# EAGLE design shieldV5 (EAGLE 8.7.1)

## Sheet 1 of 6
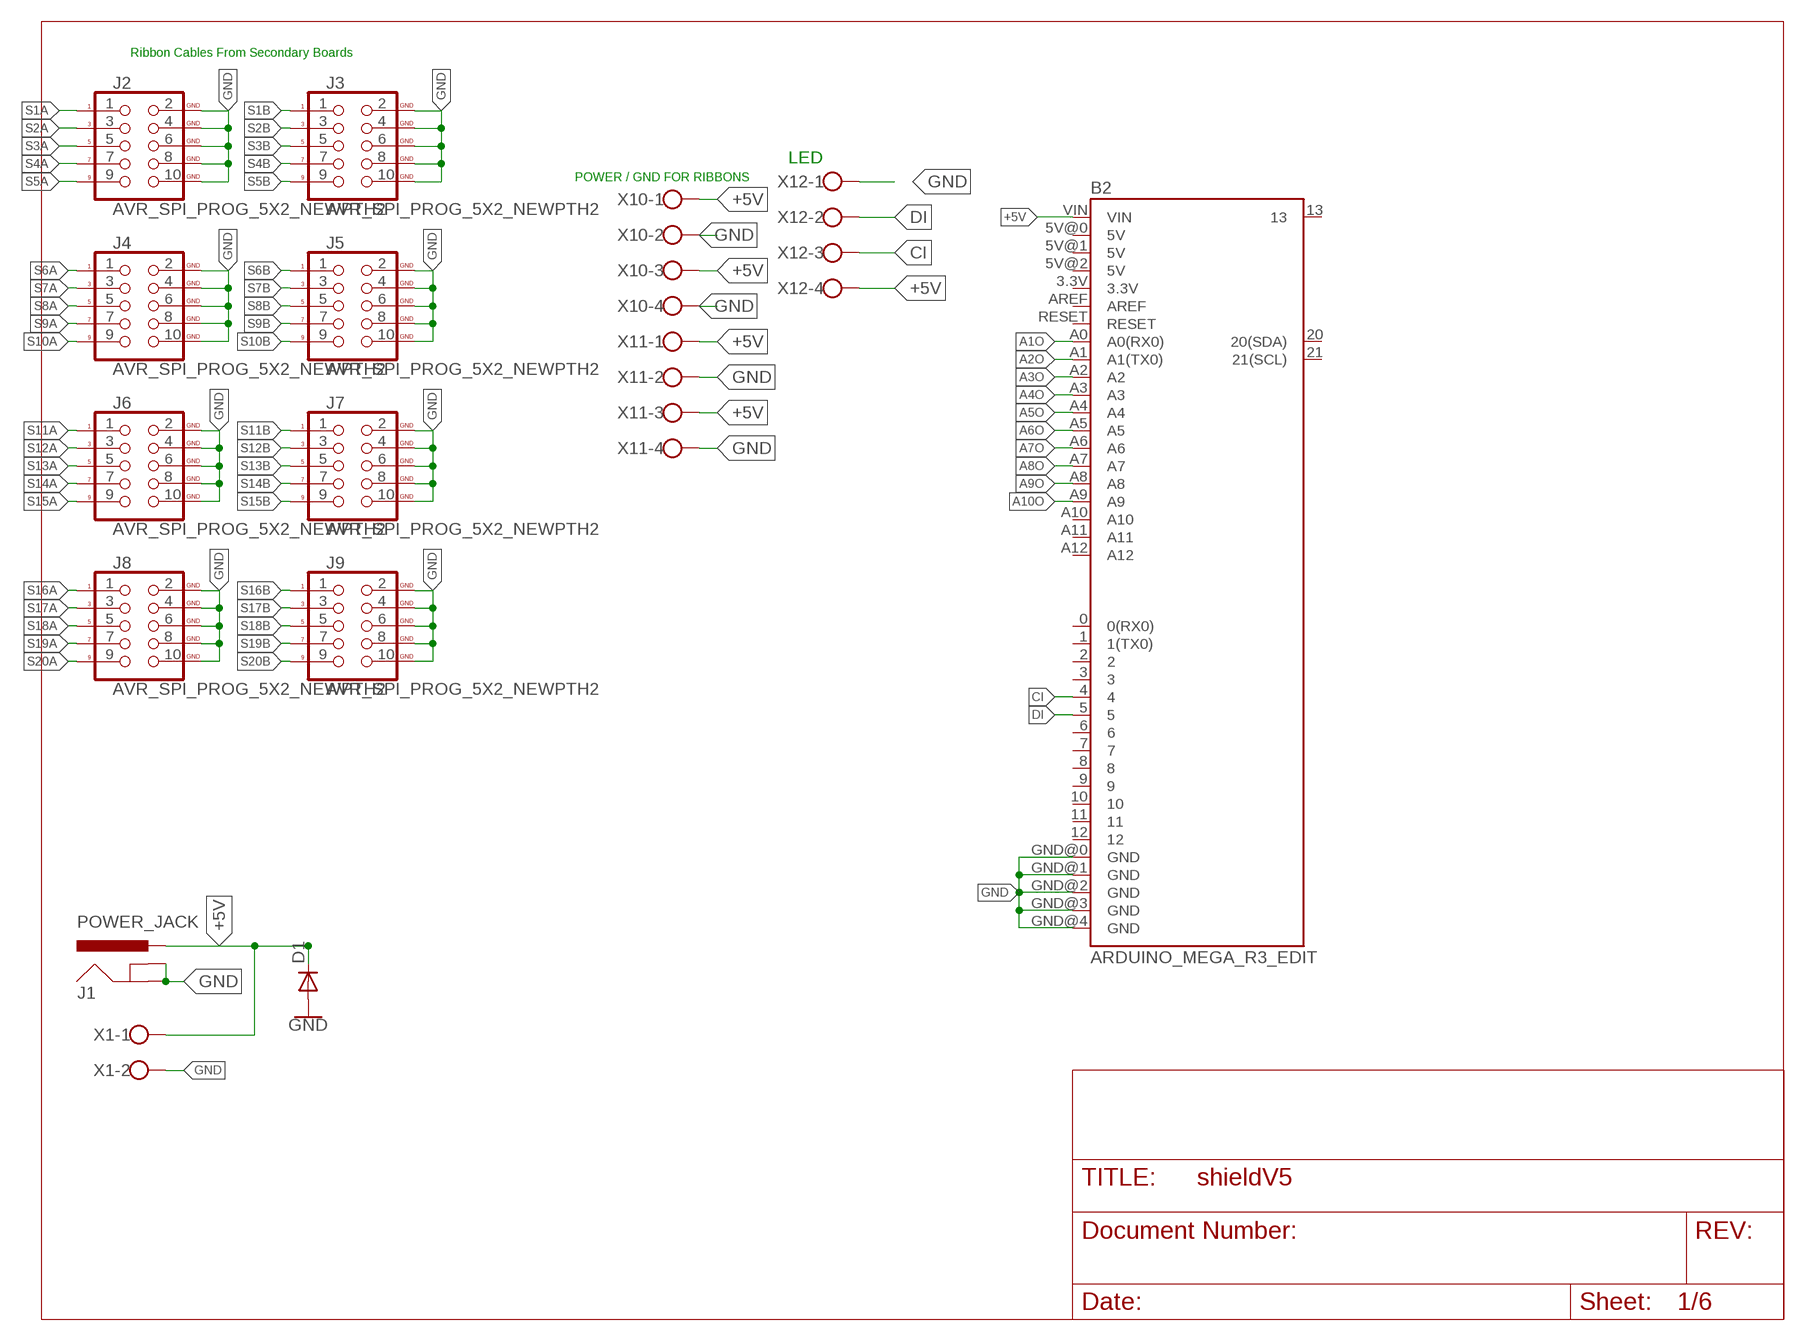
[diagram p0: schematic, sheet 1, part 1 of 2]
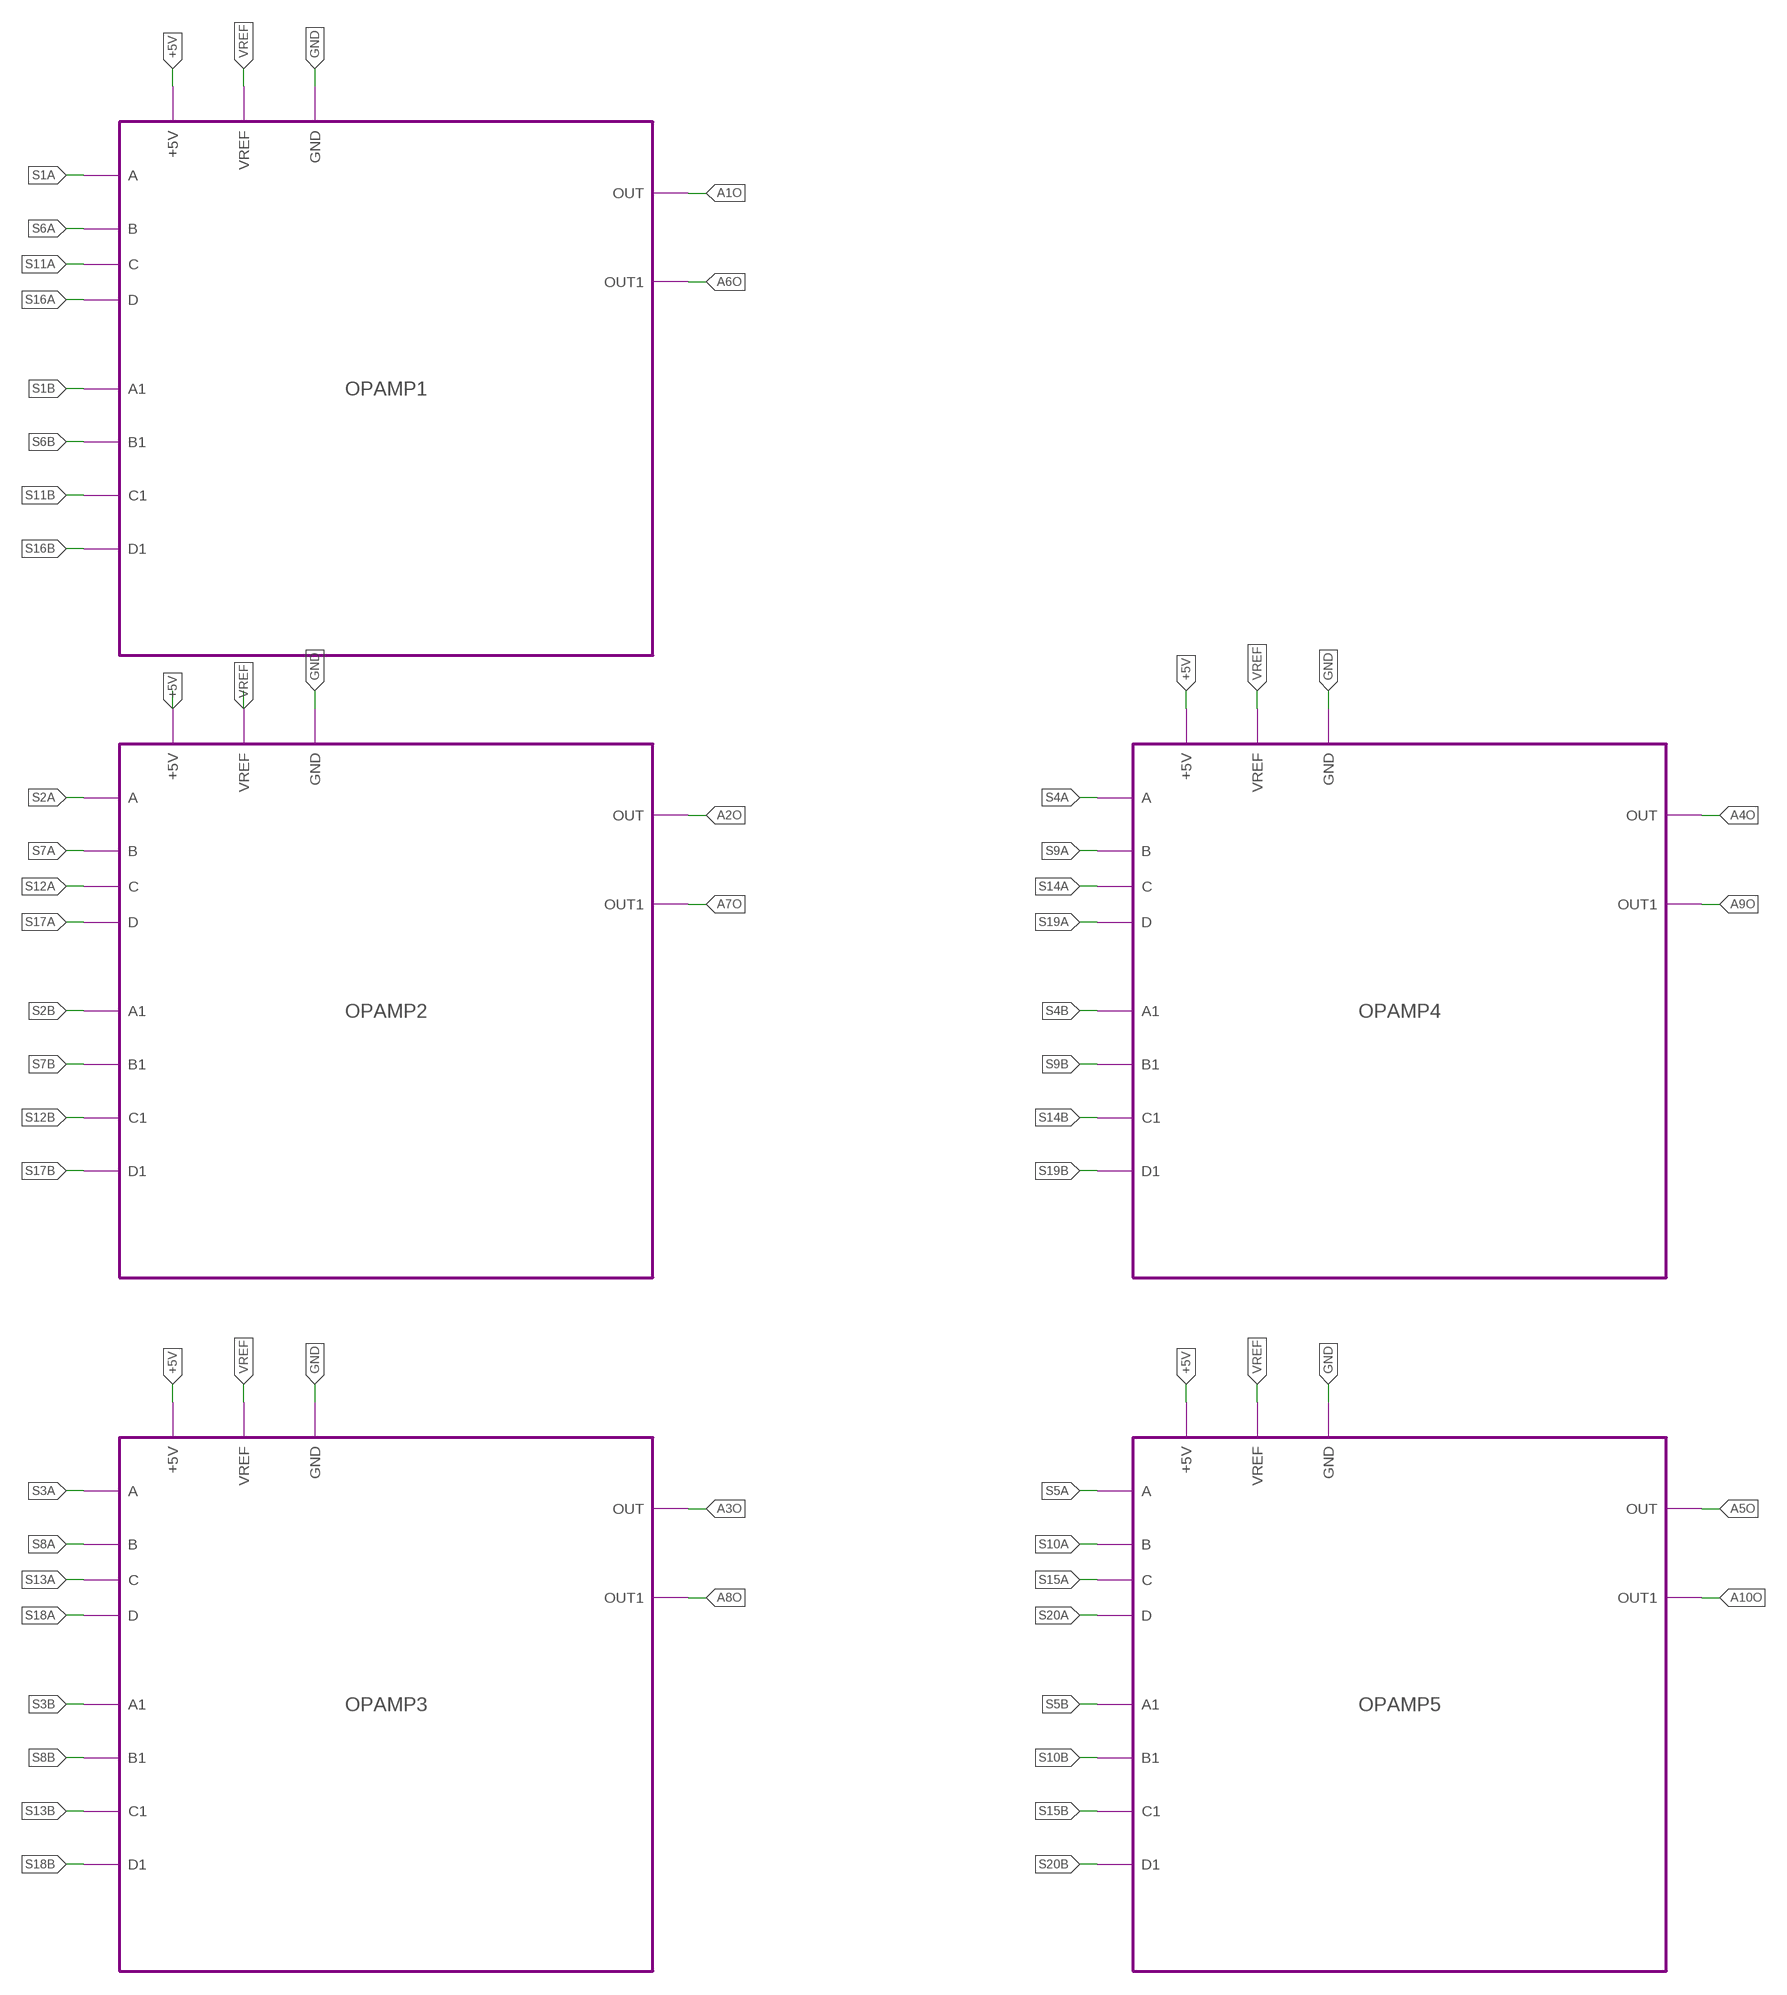
[diagram p1: schematic, sheet 1, part 2 of 2]

### Parts
B2  ARDUINO_MEGA_R3_EDIT  [ARDUINO_MEGA_EDIT]
D1  DIODE-DO-214AC  [DO-214AC]
J1  POWER_JACK  [POWER_JACK_PTH]
J2  AVR_SPI_PROG_5X2_NEWPTH2  [2X5-SHROUDED]
J3  AVR_SPI_PROG_5X2_NEWPTH2  [2X5-SHROUDED]
J4  AVR_SPI_PROG_5X2_NEWPTH2  [2X5-SHROUDED]
J5  AVR_SPI_PROG_5X2_NEWPTH2  [2X5-SHROUDED]
J6  AVR_SPI_PROG_5X2_NEWPTH2  [2X5-SHROUDED]
J7  AVR_SPI_PROG_5X2_NEWPTH2  [2X5-SHROUDED]
J8  AVR_SPI_PROG_5X2_NEWPTH2  [2X5-SHROUDED]
J9  AVR_SPI_PROG_5X2_NEWPTH2  [2X5-SHROUDED]
X1  W237-102  [W237-102]
X10  W237-4  [W237-4]
X11  W237-4  [W237-4]
X12  W237-4  [W237-4]

### Module instances
OPAMP1 = OPAMP
OPAMP2 = OPAMP
OPAMP3 = OPAMP
OPAMP4 = OPAMP
OPAMP5 = OPAMP

### Nets
+5V: B2.VIN D1.C J1.PWR X1.1 X10.1 X10.3 X11.1 X11.3 X12.4 ; port OPAMP1.+5V OPAMP2.+5V OPAMP4.+5V OPAMP3.+5V OPAMP5.+5V
A1O: B2.A0(A0(RX0)) ; port OPAMP1.OUT
A2O: B2.A1(A1(TX0)) ; port OPAMP2.OUT
A3O: B2.A2 ; port OPAMP3.OUT
A4O: B2.A3 ; port OPAMP4.OUT
A5O: B2.A4 ; port OPAMP5.OUT
A6O: B2.A5 ; port OPAMP1.OUT1
A7O: B2.A6 ; port OPAMP2.OUT1
A8O: B2.A7 ; port OPAMP3.OUT1
A9O: B2.A8 ; port OPAMP4.OUT1
A10O: B2.A9 ; port OPAMP5.OUT1
CI: B2.4 X12.3
DI: B2.5 X12.2
GND: B2.GND@0(GND) B2.GND@1(GND) B2.GND@2(GND) B2.GND@3(GND) B2.GND@4(GND) D1.A J1.GND J1.GNDBREAK J2.2(GND) J2.4(GND) J2.6(GND) J2.8(GND) J2.10(GND) J3.2(GND) J3.4(GND) J3.6(GND) J3.8(GND) J3.10(GND) J4.2(GND) J4.4(GND) J4.6(GND) J4.8(GND) J4.10(GND) J5.2(GND) J5.4(GND) J5.6(GND) J5.8(GND) J5.10(GND) J6.2(GND) J6.4(GND) J6.6(GND) J6.8(GND) J6.10(GND) J7.2(GND) J7.4(GND) J7.6(GND) J7.8(GND) J7.10(GND) J8.2(GND) J8.4(GND) J8.6(GND) J8.8(GND) J8.10(GND) J9.2(GND) J9.4(GND) J9.6(GND) J9.8(GND) J9.10(GND) X1.2 X10.2 X10.4 X11.2 X11.4 X12.1 ; port OPAMP1.GND OPAMP2.GND OPAMP4.GND OPAMP3.GND OPAMP5.GND
S1A: J2.1 ; port OPAMP1.A
S1B: J3.1 ; port OPAMP1.A1
S2A: J2.3 ; port OPAMP2.A
S2B: J3.3 ; port OPAMP2.A1
S3A: J2.5 ; port OPAMP3.A
S3B: J3.5 ; port OPAMP3.A1
S4A: J2.7 ; port OPAMP4.A
S4B: J3.7 ; port OPAMP4.A1
S5A: J2.9 ; port OPAMP5.A
S5B: J3.9 ; port OPAMP5.A1
S6A: J4.1 ; port OPAMP1.B
S6B: J5.1 ; port OPAMP1.B1
S7A: J4.3 ; port OPAMP2.B
S7B: J5.3 ; port OPAMP2.B1
S8A: J4.5 ; port OPAMP3.B
S8B: J5.5 ; port OPAMP3.B1
S9A: J4.7 ; port OPAMP4.B
S9B: J5.7 ; port OPAMP4.B1
S10A: J4.9 ; port OPAMP5.B
S10B: J5.9 ; port OPAMP5.B1
S11A: J6.1 ; port OPAMP1.C
S11B: J7.1 ; port OPAMP1.C1
S12A: J6.3 ; port OPAMP2.C
S12B: J7.3 ; port OPAMP2.C1
S13A: J6.5 ; port OPAMP3.C
S13B: J7.5 ; port OPAMP3.C1
S14A: J6.7 ; port OPAMP4.C
S14B: J7.7 ; port OPAMP4.C1
S15A: J6.9 ; port OPAMP5.C
S15B: J7.9 ; port OPAMP5.C1
S16A: J8.1 ; port OPAMP1.D
S16B: J9.1 ; port OPAMP1.D1
S17A: J8.3 ; port OPAMP2.D
S17B: J9.3 ; port OPAMP2.D1
S18A: J8.5 ; port OPAMP3.D
S18B: J9.5 ; port OPAMP3.D1
S19A: J8.7 ; port OPAMP4.D
S19B: J9.7 ; port OPAMP4.D1
S20A: J8.9 ; port OPAMP5.D
S20B: J9.9 ; port OPAMP5.D1
VREF: port OPAMP1.VREF OPAMP2.VREF OPAMP4.VREF OPAMP3.VREF OPAMP5.VREF
Unconnected: B2.0(0(RX0)) B2.1(1(TX0)) B2.2 B2.3 B2.3.3V B2.5V@0(5V) B2.5V@1(5V) B2.5V@2(5V) B2.6 B2.7 B2.8 B2.9 B2.10 B2.11 B2.12 B2.13 B2.20(20(SDA)) B2.21(21(SCL)) B2.A10 B2.A11 B2.A12 B2.AREF B2.RESET

### Notes on the sheet
- Ribbon Cables From Secondary Boards
- LED
- POWER / GND FOR RIBBONS

## Sheet 2 of 6

## Sheet 3 of 6

## Sheet 4 of 6

## Sheet 5 of 6

## Sheet 6 of 6
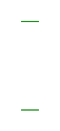
[diagram p2: schematic, sheet 6]

## Library data of the parts
B2 = SparkFun-Boards:ARDUINO_MEGA_R3_EDIT: Arduino Mega R3 ATmega2560 R3 compatible footprint. SparkFun Products: Arduino Mega 2560 R3 <https://www.sparkfun.com/products/11061>
D1 = diode:DIODE-: DIODE
J1 = SparkFun-Connectors:POWER_JACK: Power Jack Connector This is the standard 5.5mm barrel jack for power. The PTH is the most common, proven, reliable, footprint. The Slot footprint only works if the mill layer is transmitted to the PCB fab house so be warned. Here are the connectors we sell at SparkFun: DC Barrel Power Jack/Connector <https://www.sparkfun.com/products/119> (PRT-00119) DC Barrel Power Jack/Connector (SMD) <https://www.sparkfun.com/products/12748> (PRT-12748) DC Barrel Jack Adapter - Breadboard Compatible <https://www.sparkfun.com/products/10811> (PRT-10811) It is used on this SparkFun product (and many, many others): SparkFun RedBoard - Programmed with Arduino <https://www.sparkfun.com/products/12757> (DEV-12757) Also, if you need a mating power supply or connector, please check these out: Wall Adapter Power Supply - 9VDC 650mA <https://www.sparkfun.com/products/298> (TOL-00298) DC Barrel Jack Adapter - Male <https://www.sparkfun.com/products/10287> (PRT-10287); PROD_ID: CONN-08197
J2-J9 = SparkFun-Connectors:AVR_SPI_PROG_5X2_NEW: AVR 10-pin ICSP Header This is the standard AVR In Circuit Serial Programming header. Minimal, but includes pin one indicator. Works with standard Olimex programmers. SparkFun Products: 2x5 AVR ICSP Male Header <https://www.sparkfun.com/products/778> - PTH 2x5 Pin Shrouded Header <https://www.sparkfun.com/products/8506> - PTH2; PROD_ID: CONN-08671; SF_ID: PRT-08506
X1 = con-wago-500:W237-102: WAGO SCREW CLAMP; MPN: 237-102; OC_FARNELL: unknown; OC_NEWARK: 70K9898
X10-X12 = con-wago-500:W237-4: WAGO SCREW CLAMP; OC_FARNELL: unknown; OC_NEWARK: unknown

## Module OPAMP
Ports: A(in) B(in) C(in) D(in) A1(in) B1(in) C1(in) D1(in) +5V(pwr) VREF(pwr) GND(pwr) OUT(out) OUT1(out)
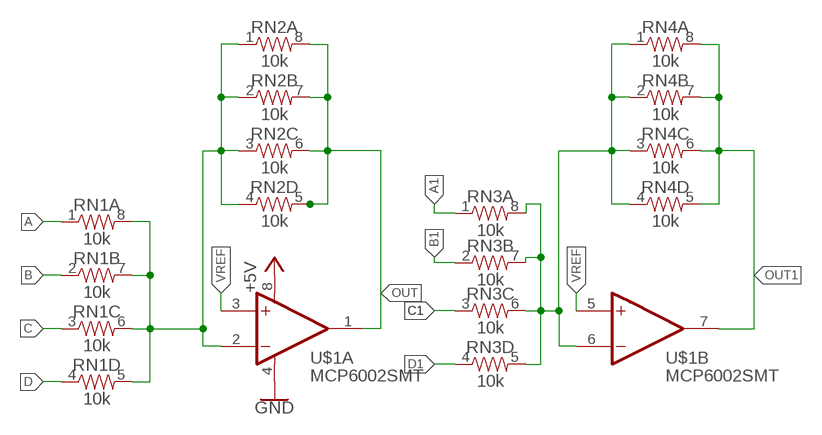
[diagram p3: schematic, module OPAMP, sheet 1]

### Parts
RN1  10k  1KOHM-ARRAY(4)0805-ARV-EDIT10K  [0805-ARV_EDIT10K]
RN2  10k  1KOHM-ARRAY(4)0805-ARV-EDIT10K  [0805-ARV_EDIT10K]
RN3  10k  1KOHM-ARRAY(4)0805-ARV-EDIT10K  [0805-ARV_EDIT10K]
RN4  10k  1KOHM-ARRAY(4)0805-ARV-EDIT10K  [0805-ARV_EDIT10K]
U$1  MCP6002SMT  [SOIC8]

### Nets
+5V: U$1.8(A:V+)
A: RN1.1
A1: RN3.1
B: RN1.2
B1: RN3.2
C: RN1.3
C1: RN3.3
D: RN1.4
D1: RN3.4
GND: U$1.4(A:V-)
N$1: RN3.5 RN3.6 RN3.7 RN3.8 RN4.1 RN4.2 RN4.3 RN4.4 U$1.6(B:-IN)
N$2: RN1.5 RN1.6 RN1.7 RN1.8 RN2.1 RN2.2 RN2.3 RN2.4 U$1.2(A:-IN)
OUT: RN2.5 RN2.6 RN2.7 RN2.8 U$1.1(A:OUT)
OUT1: RN4.5 RN4.6 RN4.7 RN4.8 U$1.7(B:OUT)
VREF: U$1.3(A:+IN) U$1.5(B:+IN)

### Library data of the parts
RN1-RN4 = SparkFun-Resistors:1KOHM-ARRAY(4): 4 x 1kΩ resistor array A resistor is a passive two-terminal electrical component that implements electrical resistance as a circuit element. Resistors act to reduce current flow, and, at the same time, act to lower voltage levels within circuits. - Wikipedia An array is a collection of discrete resistors in a single package.
U$1 = adam - ics:MCP6002: Dual General Op Amp 1.8V min supply 1MHz (6V/us)

## Board
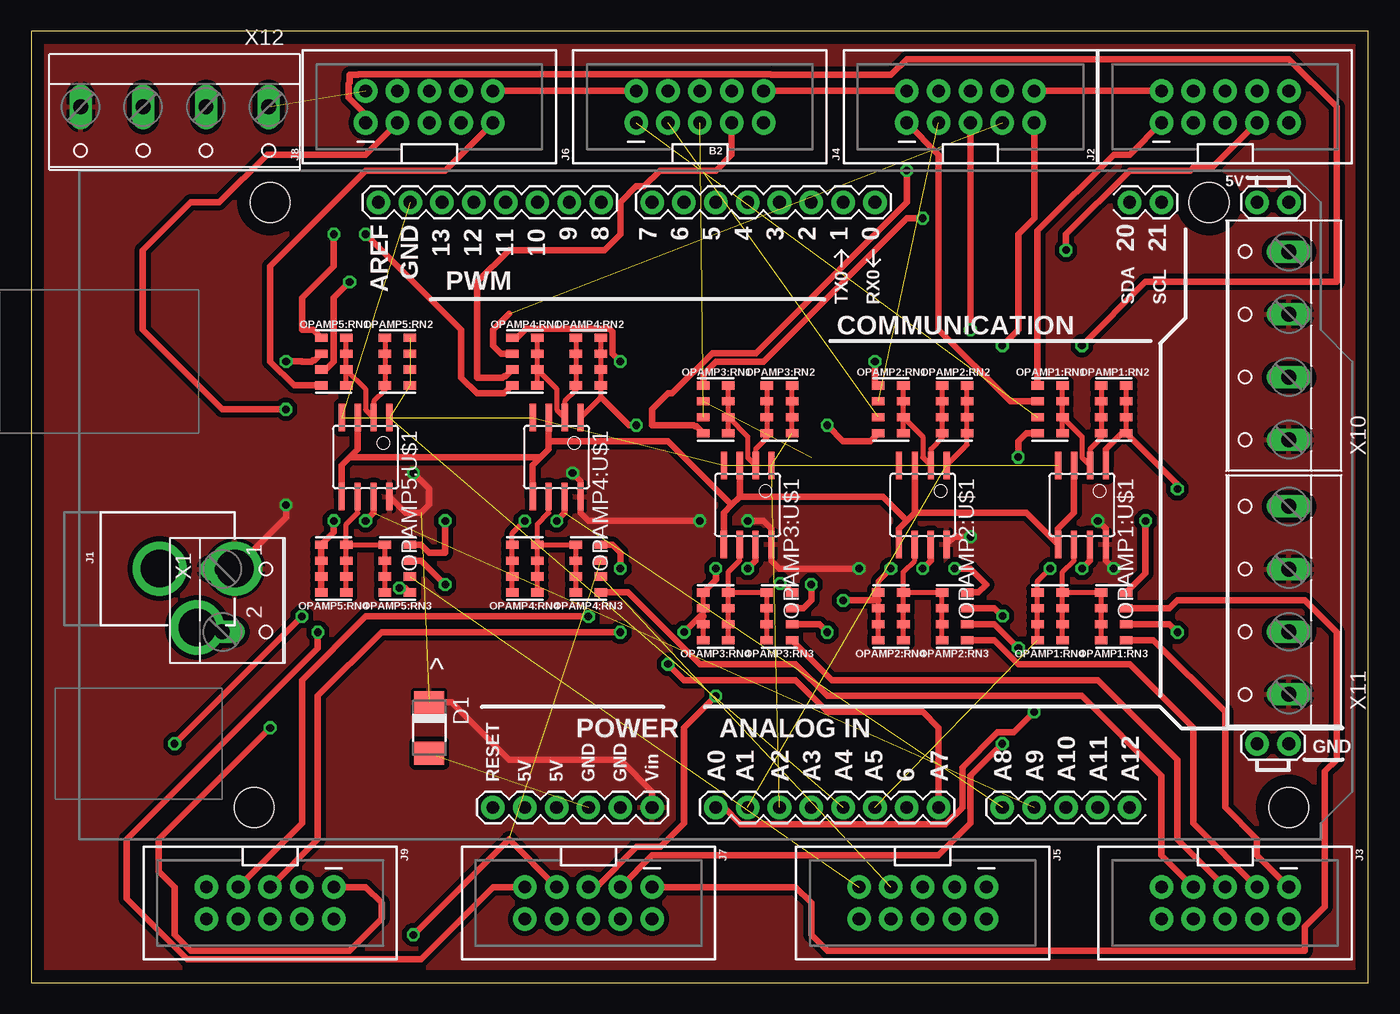
[diagram p4: board, top side]
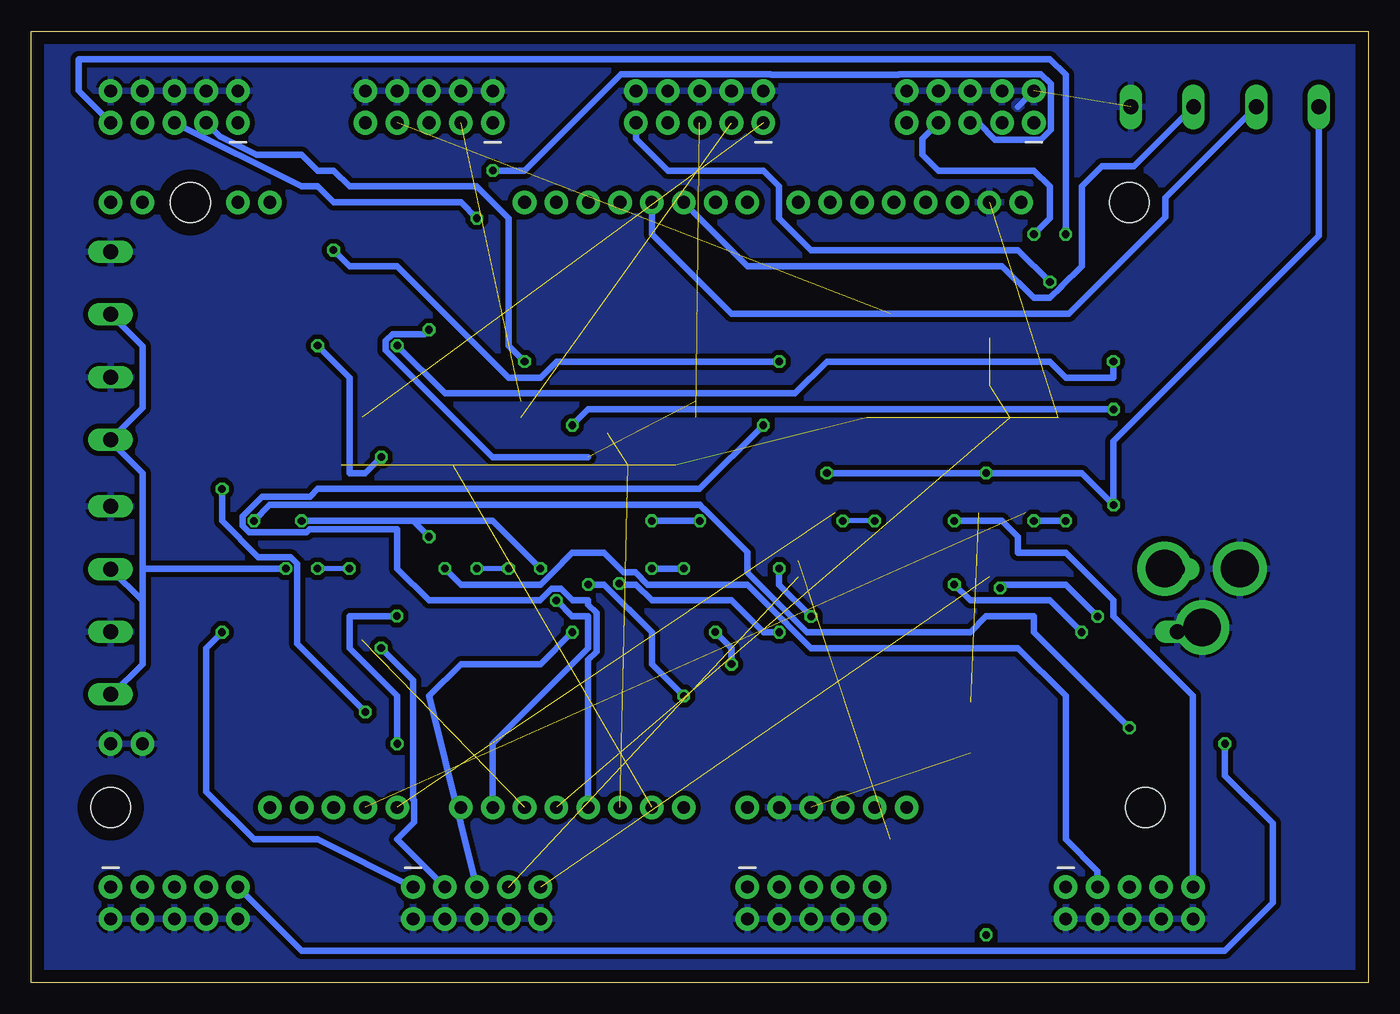
[diagram p5: board, bottom side, seen from below]

Size 106.66 x 75.87 mm. Coordinates in mm from the lower left corner, seen from the top.
Outline: 0,0 106.66,0 106.66,75.87 0,75.87 0,0
Copper layers (1*16): Top 0.035mm / dielectric 1.5mm / Bottom 0.035mm
Design rules "default": minimum track width 6mil, minimum drill 0.35mm, track to track 6mil, track to pad 6mil, pad to pad 6mil, via to via 6mil, smd to smd 6mil, copper to edge 40mil, drill to drill 6mil, minimum pad ring 10mil, minimum via ring 8mil, stop-mask expansion 4mil, vias tented up to drill 0mil, thermal gap 10mil

### Footprints (pad centres in the part's own frame; a part is rotated, then mirrored left to right if it is on the bottom)
ARDUINO_MEGA_EDIT = drill 1.016 pad 1.88: 0 13.97,24.13; 1 11.43,24.13; 2 8.89,24.13; 3 6.35,24.13; 3.3V -13.97,-24.13; 4 3.81,24.13; 5 1.27,24.13; 5V@0 -11.43,-24.13; 5V@1 44.45,24.13; 5V@2 46.99,24.13; 6 -1.27,24.13; 7 -3.81,24.13; 8 -7.874,24.13; 9 -10.414,24.13; 10 -12.954,24.13; 11 -15.494,24.13; 12 -18.034,24.13; 13 -20.574,24.13; 20 34.29,24.13; 21 36.83,24.13; A0 1.27,-24.13; A1 3.81,-24.13; A2 6.35,-24.13; A3 8.89,-24.13; A4 11.43,-24.13; A5 13.97,-24.13; A6 16.51,-24.13; A7 19.05,-24.13; A8 24.13,-24.13; A9 26.67,-24.13; A10 29.21,-24.13; A11 31.75,-24.13; A12 34.29,-24.13; AREF -25.654,24.13; GND@0 -8.89,-24.13; GND@1 -6.35,-24.13; GND@2 44.45,-19.05; GND@3 46.99,-19.05; GND@4 -23.114,24.13; RESET -16.51,-24.13; VIN -3.81,-24.13 | hole 3.2: -34.29,24.13; -35.56,-24.13; 40.64,24.13; 46.99,-24.13
DO-214AC = smd 1.8 x 2.4: A 2.025,0; C -2.025,0
POWER_JACK_PTH = drill 2.997 pad 4.318: GND 0,7.7; GNDBREAK 4.7,10.7; PWR 0,13.7
2X5-SHROUDED = drill 1.016 pad 1.88: 1 -1.27,5.08; 2 1.27,5.08; 3 -1.27,2.54; 4 1.27,2.54; 5 -1.27,0; 6 1.27,0; 7 -1.27,-2.54; 8 1.27,-2.54; 9 -1.27,-5.08; 10 1.27,-5.08
0805-ARV_EDIT10K = smd 0.65 x 1: 1 -1.905,-1; 2 -0.635,-1; 3 0.635,-1; 4 1.905,-1; 5 1.905,1; 6 0.635,1; 7 -0.635,1; 8 -1.905,1
SOIC8 = smd 0.5 x 2.2: 1 -1.905,-3.154; 2 -0.645,-3.154; 3 0.625,-3.154; 4 1.895,-3.154; 5 1.905,3.154; 6 0.635,3.154; 7 -0.635,3.154; 8 -1.905,3.154
W237-102 = drill 1.194 long: 1 -2.5,-1.27; 2 2.5,-1.27
W237-4 = drill 1.194 long: 1 -7.5,-1.27; 2 -2.5,-1.27; 3 2.5,-1.27; 4 7.5,-1.27

### Placement (x,y rotation side)
B2  53.34,38.1 0 top
D1  31.75,20.32 270 top
J1  2.54,33.02 270 top
J2  95.25,69.85 90 top
J3  95.25,6.35 270 top
J4  74.93,69.85 90 top
J5  71.12,6.35 270 top
J6  53.34,69.85 90 top
J7  44.45,6.35 270 top
J8  31.75,69.85 90 top
J9  19.05,6.35 270 top
OPAMP1:RN1  10k  [0805-ARV_EDIT10K]  81.28,45.72 270 top
OPAMP1:RN2  10k  [0805-ARV_EDIT10K]  86.36,45.72 270 top
OPAMP1:RN3  10k  [0805-ARV_EDIT10K]  86.36,29.21 90 top
OPAMP1:RN4  10k  [0805-ARV_EDIT10K]  81.28,29.21 90 top
OPAMP1:U$1  MCP6002SMT  [SOIC8]  83.82,38.1 180 top
OPAMP2:RN1  10k  [0805-ARV_EDIT10K]  68.58,45.72 270 top
OPAMP2:RN2  10k  [0805-ARV_EDIT10K]  73.66,45.72 270 top
OPAMP2:RN3  10k  [0805-ARV_EDIT10K]  73.66,29.21 90 top
OPAMP2:RN4  10k  [0805-ARV_EDIT10K]  68.58,29.21 90 top
OPAMP2:U$1  MCP6002SMT  [SOIC8]  71.12,38.1 180 top
OPAMP3:RN1  10k  [0805-ARV_EDIT10K]  54.61,45.72 270 top
OPAMP3:RN2  10k  [0805-ARV_EDIT10K]  59.69,45.72 270 top
OPAMP3:RN3  10k  [0805-ARV_EDIT10K]  59.69,29.21 90 top
OPAMP3:RN4  10k  [0805-ARV_EDIT10K]  54.61,29.21 90 top
OPAMP3:U$1  MCP6002SMT  [SOIC8]  57.15,38.1 180 top
OPAMP4:RN1  10k  [0805-ARV_EDIT10K]  39.37,49.53 270 top
OPAMP4:RN2  10k  [0805-ARV_EDIT10K]  44.45,49.53 270 top
OPAMP4:RN3  10k  [0805-ARV_EDIT10K]  44.45,33.02 90 top
OPAMP4:RN4  10k  [0805-ARV_EDIT10K]  39.37,33.02 90 top
OPAMP4:U$1  MCP6002SMT  [SOIC8]  41.91,41.91 180 top
OPAMP5:RN1  10k  [0805-ARV_EDIT10K]  24.13,49.53 270 top
OPAMP5:RN2  10k  [0805-ARV_EDIT10K]  29.21,49.53 270 top
OPAMP5:RN3  10k  [0805-ARV_EDIT10K]  29.21,33.02 90 top
OPAMP5:RN4  10k  [0805-ARV_EDIT10K]  24.13,33.02 90 top
OPAMP5:U$1  MCP6002SMT  [SOIC8]  26.67,41.91 180 top
X1  16.51,30.48 270 top
X10  99.06,50.8 90 top
X11  99.06,30.48 90 top
X12  11.43,68.58 180 top

### Tracks (layer width: path | path; a pad name or v marks a point on that pad's centre or on a via)
+5V  (via drill 0.61)  (1 unrouted)
  Top 0.508: B2.VIN 49.53,15.24 46.99,17.78 38.1,17.78 33.53,22.34 D1.C | v86.36,33.02 85.72,33.66 OPAMP1:U$1.8 85.72,36.2 v85.09,36.83 | v53.34,36.83 44.45,36.83 43.82,37.47 OPAMP4:U$1.8 43.82,40.01 v43.18,40.64 | v57.15,36.83 58.42,36.83 59.05,36.2 OPAMP3:U$1.8 59.05,33.66 59.69,33.02 v66.04,33.02 | v20.32,38.1 20.32,37.1 J1.PWR 15.28,33.02 X1.1 | v30.48,40.64 31.75,39.37 31.75,38.1 31.12,37.47 29.87,37.47 OPAMP5:U$1.8 | OPAMP2:U$1.8 73.64,35.56 v74.93,35.56
  Bottom 0.508: X11.1 100.21,22.98 97.79,25.4 97.79,30.44 | 97.79,30.44 X11.3 | 97.79,33.02 97.79,40.64 100.33,43.18 X10.1 97.79,45.84 97.79,50.76 X10.3 | 97.79,33.02 97.79,30.44 | v86.36,33.02 97.79,33.02 | v53.34,36.83 v57.15,36.83 | v66.04,33.02 69.85,36.83 76.2,36.83 | v43.18,40.64 v30.48,40.64 22.86,40.64 v20.32,38.1 20.32,43.18 3.93,59.57 X12.4 | v85.09,36.83 76.2,36.83 | v74.93,35.56 76.2,36.83
  pour Top (isolate 0.406): 0,76.2 106.68,76.2 106.68,0 0,0
A1O  (via drill 0.61)
  Top 0.406: OPAMP1:RN2.5 OPAMP1:RN2.6 OPAMP1:RN2.7 OPAMP1:RN2.8
  Top 0.508: OPAMP1:U$1.1 85.72,42.55 87,43.81 OPAMP1:RN2.5 91.44,39.73 v91.44,39.37 | B2.A0 55.25,13.97 56.59,12.62 72.95,12.62 74.27,13.95 74.27,17.14 77.09,19.96 78.38,19.96 v80.01,21.59
  Bottom 0.508: v80.01,21.59 85.45,27.03 85.45,33.4 85.98,33.93 88.54,33.93 91.44,36.83 v91.44,39.37
A2O  (1 unrouted)
  Top 0.406: OPAMP2:U$1.1 74.66,42.89 OPAMP2:RN2.5 OPAMP2:RN2.6 OPAMP2:RN2.7 OPAMP2:RN2.8
A3O  (2 unrouted)
  Top 0.406: OPAMP3:RN2.5 OPAMP3:RN2.6 OPAMP3:RN2.7 OPAMP3:RN2.8
A4O  (via drill 0.61)
  Top 0.406: OPAMP4:U$1.1 45.45,46.7 OPAMP4:RN2.5 OPAMP4:RN2.6 OPAMP4:RN2.7 OPAMP4:RN2.8
  Top 0.508: 45.45,46.7 47.7,44.45 v48.26,44.45
  Bottom 0.508: B2.A3 62.23,25.74 61.57,26.4 61.57,29.48 62.23,30.14 62.23,30.48 63.48,30.48 64.39,31.39 65.15,31.39 66.06,30.48 74.93,30.48 77.47,33.02 77.47,36.17 84.46,36.17 84.71,35.92 89.28,35.92 89.81,36.45 89.81,37.21 88.26,38.76 84.43,38.76 83.82,39.37 53.34,39.37 v48.26,44.45
A5O  (5 unrouted)
A6O  (via drill 0.6)  (1 unrouted)
  Top 0.406: OPAMP1:RN4.8 OPAMP1:RN4.7 OPAMP1:RN4.6 OPAMP1:RN4.5 80.28,32.02 v81.28,33.02
  Top 0.508: OPAMP1:U$1.7 84.46,33.66 v83.82,33.02
  Bottom 0.406: v81.28,33.02 v83.82,33.02
A7O  (via drill 0.6, 0.61)
  Top 0.406: OPAMP2:RN4.8 OPAMP2:RN4.7 OPAMP2:RN4.6 67.58,30.48 OPAMP2:RN4.5 67.58,32.02 v68.58,33.02
  Top 0.508: OPAMP2:U$1.7 71.75,33.66 v71.12,33.02 | v64.77,30.48 67.58,30.48
  Bottom 0.406: v68.58,33.02 v71.12,33.02
  Bottom 0.508: B2.A6 69.85,19.05 62.23,26.67 62.23,29.21 63.5,29.21 v64.77,30.48
A8O  (via drill 0.61)
  Top 0.406: OPAMP3:RN4.8 OPAMP3:RN4.7 53.61,29.21 OPAMP3:RN4.6 OPAMP3:RN4.5
  Top 0.508: OPAMP3:U$1.7 57.79,33.66 v57.15,33.02 | v54.61,33.02 54.61,32.12 OPAMP3:RN4.5 | B2.A7 72.39,20.32 71.12,21.59 63.5,21.59 60.96,24.13 52.07,24.13 v50.8,25.4 | v52.08,27.95 53.34,29.21 53.61,29.21
  Bottom 0.508: v57.15,33.02 v54.61,33.02 | v50.8,25.4 50.8,26.67 v52.08,27.95
A9O  (via drill 0.6)  (1 unrouted)
  Top 0.406: OPAMP4:RN4.8 OPAMP4:RN4.7 OPAMP4:RN4.6 OPAMP4:RN4.5 38.37,35.83 v39.37,36.83
  Top 0.508: OPAMP4:U$1.7 42.54,37.47 v41.91,36.83
  Bottom 0.406: v39.37,36.83 v41.91,36.83
A10O  (via drill 0.61)  (1 unrouted)
  Top 0.508: OPAMP5:U$1.7 27.3,37.47 v26.67,36.83 | v24.13,36.83 24.13,35.93 OPAMP5:RN4.5 OPAMP5:RN4.6 OPAMP5:RN4.7 OPAMP5:RN4.8
  Bottom 0.508: v26.67,36.83 v24.13,36.83
CI
  Bottom 0.508: X12.3 16.18,62.6 16.18,61.04 23.88,53.34 50.8,53.34 57.15,59.69 B2.4
DI
  Bottom 0.508: B2.5 49.53,57.15 29.21,57.15 26.67,54.61 25.38,54.61 24.49,55.5 24.49,55.52 22.86,57.15 22.86,63.5 21.26,65.1 18.68,65.1 X12.2
GND  (7 unrouted)
  Top 0.508: J8.10 J6.2 | J6.10 J4.2 | J4.10 J2.2
  Bottom 0.508: 27.94,69.85 J8.2
  pour Bottom (isolate 0.406): 0,76.2 106.68,76.2 106.68,0 0,0
OPAMP1:N$1
  Top 0.406: OPAMP1:RN3.8 OPAMP1:RN3.7 OPAMP1:RN3.6 OPAMP1:RN3.5 82.55,31.12 | 82.55,31.12 OPAMP1:RN4.4 82.28,32.75 83.19,33.66 OPAMP1:U$1.6 | OPAMP1:RN4.1 OPAMP1:RN4.2 OPAMP1:RN4.3 82.28,30.84 82.55,31.12
OPAMP1:N$2
  Top 0.406: OPAMP1:RN1.5 OPAMP1:RN1.6 | OPAMP1:RN1.6 OPAMP1:RN1.7 OPAMP1:RN1.8 | OPAMP1:RN1.6 83.82,43.55 83.82,41.9 OPAMP1:U$1.2 84.47,42.55 85.36,43.45 OPAMP1:RN2.4 OPAMP1:RN2.3 OPAMP1:RN2.2 OPAMP1:RN2.1
OPAMP2:N$1
  Top 0.406: OPAMP2:RN3.8 OPAMP2:RN3.7 OPAMP2:RN3.6 OPAMP2:RN3.5 69.85,31.12 | 69.85,31.12 OPAMP2:RN4.4 69.58,32.75 70.48,33.66 OPAMP2:U$1.6 | OPAMP2:RN4.1 OPAMP2:RN4.2 OPAMP2:RN4.3 69.58,30.84 69.85,31.12
OPAMP2:N$2
  Top 0.406: OPAMP2:RN1.5 OPAMP2:RN1.6 | OPAMP2:RN1.6 OPAMP2:RN1.7 OPAMP2:RN1.8 | OPAMP2:RN1.6 71.12,43.55 71.12,41.9 OPAMP2:U$1.2 71.76,42.55 72.66,43.45 OPAMP2:RN2.4 OPAMP2:RN2.3 OPAMP2:RN2.2 OPAMP2:RN2.1
OPAMP3:N$1
  Top 0.406: OPAMP3:RN3.8 OPAMP3:RN3.7 OPAMP3:RN3.6 OPAMP3:RN3.5 55.88,31.12 | 55.88,31.12 OPAMP3:RN4.4 55.61,32.75 56.51,33.66 OPAMP3:U$1.6 | OPAMP3:RN4.1 OPAMP3:RN4.2 OPAMP3:RN4.3 55.61,30.84 55.88,31.12
OPAMP3:N$2
  Top 0.406: OPAMP3:RN1.5 OPAMP3:RN1.6 | OPAMP3:RN1.6 OPAMP3:RN1.7 OPAMP3:RN1.8 | OPAMP3:RN1.6 57.15,43.55 57.15,41.9 OPAMP3:U$1.2 57.79,42.55 58.69,43.45 OPAMP3:RN2.4 OPAMP3:RN2.3 OPAMP3:RN2.2 OPAMP3:RN2.1
OPAMP4:N$1
  Top 0.406: OPAMP4:RN3.8 OPAMP4:RN3.7 OPAMP4:RN3.6 OPAMP4:RN3.5 40.64,34.93 | 40.64,34.93 OPAMP4:RN4.4 40.37,36.56 41.27,37.47 OPAMP4:U$1.6 | OPAMP4:RN4.1 OPAMP4:RN4.2 OPAMP4:RN4.3 40.37,34.66 40.64,34.93
OPAMP4:N$2
  Top 0.406: OPAMP4:RN1.5 OPAMP4:RN1.6 | OPAMP4:RN1.6 OPAMP4:RN1.7 OPAMP4:RN1.8 | OPAMP4:RN1.6 41.91,47.36 41.91,45.71 OPAMP4:U$1.2 42.55,46.37 43.45,47.26 OPAMP4:RN2.4 OPAMP4:RN2.3 OPAMP4:RN2.2 OPAMP4:RN2.1
OPAMP5:N$1
  Top 0.406: OPAMP5:RN3.8 OPAMP5:RN3.7 OPAMP5:RN3.6 OPAMP5:RN3.5 25.4,34.93 | 25.4,34.93 OPAMP5:RN4.4 25.13,36.56 26.03,37.47 OPAMP5:U$1.6 | OPAMP5:RN4.1 OPAMP5:RN4.2 OPAMP5:RN4.3 25.13,34.66 25.4,34.93
OPAMP5:N$2
  Top 0.406: OPAMP5:RN1.5 OPAMP5:RN1.6 | OPAMP5:RN1.6 OPAMP5:RN1.7 OPAMP5:RN1.8 | OPAMP5:RN1.6 26.67,47.36 26.67,45.71 OPAMP5:U$1.2 27.31,46.37 28.21,47.26 OPAMP5:RN2.4 OPAMP5:RN2.3 OPAMP5:RN2.2 OPAMP5:RN2.1
S1A
  Top 0.508: J2.1 87.63,66.04 86.36,66.04 80.28,59.96 OPAMP1:RN1.1
S1B
  Top 0.508: J3.1 97.79,10.16 97.79,11.43 95.25,13.97 95.25,21.59 89.53,27.3 OPAMP1:RN3.1
S2A  (via drill 0.61)
  Top 0.508: v67.31,49.53 67.31,47.9 OPAMP2:RN1.1
  Bottom 0.508: v67.31,49.53 68.58,50.8 68.58,60.96 71.12,63.5 81.28,63.5 82.55,64.77 83.82,64.77 85.09,66.04 88.69,66.04 91.65,67.52 J2.3
S2B
  Top 0.508: J3.3 92.71,12.7 92.71,20.32 87.63,25.4 78.74,25.4 76.84,27.3 OPAMP2:RN3.1
S3A  (via drill 0.61)
  Top 0.508: v71.12,60.96 69.85,60.96 58.42,49.53 54.61,49.53 53.61,48.53 OPAMP3:RN1.1
  Bottom 0.508: J2.5 85.09,63.5 83.82,63.5 82.55,62.23 72.39,62.23 v71.12,60.96
S3B
  Top 0.508: J3.5 91.44,11.43 91.44,17.78 85.09,24.13 63.87,24.13 OPAMP3:RN3.1
S4A  (via drill 0.61)
  Top 0.508: J2.7 94.31,65.1 92.79,65.1 92.46,64.77 87.63,64.77 82.55,59.69 v82.55,58.42 | OPAMP4:RN1.1 38.73,51.44 39.47,52.17 46.12,52.17 46.36,51.93 46.36,50.16 v46.99,49.53
  Bottom 0.508: v82.55,58.42 81.28,57.15 77.47,57.15 68.58,48.26 66.04,48.26 64.77,49.53 v46.99,49.53
S4B
  Top 0.508: J3.7 90.17,10.16 90.17,16.51 83.82,22.86 63.5,22.86 60.96,25.4 53.34,25.4 47.62,31.12 OPAMP4:RN3.1
S5A  (via drill 0.61)
  Top 0.508: v24.13,59.69 24.13,57.15 21.59,54.61 21.59,52.07 22.49,52.07 OPAMP5:RN1.1
  Bottom 0.508: J2.9 102.87,71.12 102.87,73.66 25.4,73.66 24.13,72.39 v24.13,59.69
S5B  (via drill 0.61)
  Top 0.508: v11.43,19.05 v21.59,29.21 | v29.37,31.47 29.86,31.47 OPAMP5:RN3.1
  Bottom 0.508: J3.9 85.09,2.54 11.43,2.54 7.62,6.35 7.62,12.7 11.43,16.51 v11.43,19.05 | v21.59,29.21 24.13,31.75 29.21,31.75 29.37,31.59 v29.37,31.47
S6A
  Top 0.508: J4.1 72.39,66.04 72.39,52.07 78.1,46.36 OPAMP1:RN1.2
S6B  (via drill 0.61)
  Top 0.508: v91.44,27.94 90.81,28.58 OPAMP1:RN3.2
  Bottom 0.508: J5.1 83.82,11.43 88.9,11.43 92.71,15.24 92.71,26.67 v91.44,27.94
S7A  (1 unrouted)
S7B  (via drill 0.61)
  Top 0.508: v78.75,26.68 76.86,28.58 OPAMP2:RN3.2
  Bottom 0.508: J5.3 77.47,11.43 76.12,12.78 76.12,14.53 76.2,14.6 76.2,24.13 v78.75,26.68
S8A  (via drill 0.61)  (1 unrouted)
  Top 0.508: J4.5 v74.93,52.07
  Bottom 0.508: v74.93,52.07 75.29,51.71 77.85,51.71 78.38,51.18 78.38,50.42 69.87,41.91 62.23,41.91
S8B  (via drill 0.61)
  Top 0.508: v63.5,27.94 62.87,28.58 OPAMP3:RN3.2
  Bottom 0.508: v63.5,27.94 66.04,25.4 72.39,25.4 74.93,22.86 J5.5
S9A  (1 unrouted)
  Top 0.508: OPAMP4:RN1.2 37.46,50.17 36.83,50.8 36.83,52.07 38.1,53.34
S9B  (1 unrouted)
S10A  (via drill 0.61)
  Top 0.508: v20.33,49.54 21.58,49.54 21.59,49.53 22.37,49.53 22.46,49.63 22.59,49.63 OPAMP5:RN1.2 | J4.9 80.01,60.96 78.74,59.69 78.74,52.07 v77.47,50.8
  Bottom 0.508: v77.47,50.8 73.66,46.99 45.72,46.99 43.18,49.53 25.4,49.53 24.13,48.26 20.32,48.26 v20.32,49.53 v20.33,49.54
S10B  (1 unrouted)
S11A  (1 unrouted)
S11B
  Top 0.508: OPAMP1:RN3.3 90.81,29.84 91.44,30.48 101.6,30.48 104.14,27.94 104.14,17.78 103.2,16.84 103.2,6.05 101.6,4.45 101.6,2.54 63.5,2.54 62.23,3.81 62.23,6.35 60.96,7.62 J7.1
S12A  (1 unrouted)
S12B  (via drill 0.61)
  Top 0.508: OPAMP2:RN3.3 76.84,29.84 77.47,29.21 v77.49,29.23 | v77.47,19.05 74.93,16.51 74.93,12.7 72.39,10.16 49.53,10.16 J7.3
  Bottom 0.508: v77.49,29.23 81.26,29.23 81.28,29.21 81.28,26.67 77.47,22.86 v77.47,19.05
S13A  (1 unrouted)
S13B  (via drill 0.61)
  Top 0.508: J7.5 45.09,7.62 48.29,10.82 50.19,10.82 52.07,12.7 52.07,20.32 v54.61,22.86 | v62.23,31.75 62.23,30.48 61.6,29.84 OPAMP3:RN3.3
  Bottom 0.508: v54.61,22.86 57.15,25.4 57.15,27.94 60.96,31.75 v62.23,31.75
S14A
  Top 0.508: J6.7 55.88,66.04 54.61,64.77 50.17,64.77 48.9,63.5 48.26,63.5 46.99,62.23 46.99,59.69 45.72,58.42 38.1,58.42 35.56,55.88 35.56,48.26 37.6,48.26 37.7,48.36 37.83,48.36 OPAMP4:RN1.3
S14B  (via drill 0.61)  (1 unrouted)
  Top 0.508: J7.7 38.1,11.43 v30.48,3.81
S15A  (via drill 0.61)
  Top 0.508: v25.4,55.88 24.13,54.61 24.13,49.53 23.49,48.9 OPAMP5:RN1.3
  Bottom 0.508: v25.4,55.88 27.94,58.42 44.45,58.42 46.99,60.96 46.99,63.5 48.26,64.77 55.88,64.77 58.42,67.31 J6.9
S15B  (via drill 0.61)
  Top 0.508: J7.9 36.83,7.62 31.09,1.88 12.43,1.88 7.62,6.69 7.62,11.43 22.86,26.67 v22.86,27.94 | v33.02,31.75 31.12,33.66 OPAMP5:RN3.3
  Bottom 0.508: v22.86,27.94 25.4,30.48 31.75,30.48 v33.02,31.75
S16A  (via drill 0.61)
  Top 0.508: J8.1 26.67,69.22 25.32,70.56 25.32,71.68 25.4,71.75 25.4,72.39 26.04,72.39 26.11,72.47 58.98,72.47 59.05,72.39 68.58,72.39 69.85,73.66 100.33,73.66 104.14,69.85 104.14,55.88 88.9,55.88 v83.82,50.8 | v78.74,41.91 78.74,43.18 79.38,43.81 OPAMP1:RN1.4
  Bottom 0.508: v83.82,50.8 81.28,48.26 81.28,40.64 80.01,40.64 v78.74,41.91
S16B  (via drill 0.61)
  Top 0.508: OPAMP1:RN3.4 88.9,32.66 v88.9,36.83 | 12.7,13.97 v19.05,20.32 10.16,11.43 10.16,8.89 11.43,7.62 11.43,3.81 12.7,2.54 25.4,2.54 27.94,5.08 27.94,6.35 26.67,7.62 J9.1
  Bottom 0.508: v88.9,36.83 87.63,38.1 53.32,38.1 53.32,38.08 52.98,37.74 52.96,37.74 49.53,34.31 49.53,32.71 44.76,27.94 31.75,27.94 30.48,29.21 26.67,29.21 26.67,27.94 v19.05,20.32
S17A  (via drill 0.61)
  Top 0.508: J8.3 26.67,66.04 18.8,66.04 14.99,62.23 12.7,62.23 8.89,58.42 8.89,52.07 15.24,45.72 v20.32,45.72 | v63.5,44.45 64.77,43.18 66.94,43.18 OPAMP2:RN1.4
  Bottom 0.508: v20.32,45.72 39.37,45.72 62.23,45.72 v63.5,44.45
S17B  (via drill 0.61)
  Top 0.508: v73.66,33.02 74.93,33.02 76.2,31.75 75.56,31.12 OPAMP2:RN3.4
  Bottom 0.508: J9.3 21.59,8.89 24.13,11.43 24.13,22.86 27.94,26.67 44.45,26.67 46.08,28.3 46.08,28.32 46.61,28.85 46.63,28.85 49.53,31.75 57.49,31.75 58.47,32.74 59.41,32.74 60.96,34.29 63.5,34.29 65.13,32.66 65.13,32.64 65.66,32.11 65.68,32.11 66.04,31.75 72.39,31.75 v73.66,33.02
S18A  (via drill 0.61)
  Top 0.508: v69.85,64.77 69.85,62.23 57.81,50.19 54.34,50.19 51.14,46.99 50.8,46.99 49.53,45.72 49.53,44.45 52.85,44.45 52.94,44.35 53.07,44.35 OPAMP3:RN1.4
  Bottom 0.508: J8.5 31.11,68.58 29.77,67.23 26.11,67.23 25.32,68.02 25.32,71.68 26.11,72.47 37.39,72.47 37.46,72.39 47.63,72.39 47.7,72.47 59.61,72.47 67.31,64.77 v69.85,64.77
S18B  (via drill 0.61)
  Top 0.508: J9.5 22.86,11.43 22.86,22.86 27.94,27.94 v46.99,27.94 | 60.45,31.12 OPAMP3:RN3.4 59.98,31.82 v59.74,31.82
  Bottom 0.508: v46.99,27.94 48.26,27.94 50.8,30.48 57.15,30.48 58.42,31.75 59.69,31.75 59.74,31.8 v59.74,31.82
S19A  (via drill 0.61)
  Top 0.508: v26.67,59.69 34.29,52.07 34.29,48.26 35.56,46.99 37.73,46.99 OPAMP4:RN1.4
  Bottom 0.508: J8.7 35.56,67.31 35.56,66.04 34.29,64.77 26.67,64.77 25.4,63.5 25.4,60.96 v26.67,59.69
S19B  (via drill 0.61)
  Top 0.508: J9.7 21.59,12.7 21.59,24.13 26.67,29.21 v44.45,29.21 | v46.99,33.02 46.99,34.29 46.35,34.93 OPAMP4:RN3.4
  Bottom 0.508: v44.45,29.21 46.99,31.75 v46.99,33.02
S20A
  Top 0.508: J8.9 33.02,64.77 26.67,64.77 19.05,57.15 19.05,49.53 20.95,47.62 OPAMP5:RN1.4
S20B  (via drill 0.61)
  Top 0.508: v33.02,36.83 33.02,34.29 31.75,34.29 31.12,34.93 OPAMP5:RN3.4
  Bottom 0.508: v33.02,36.83 29.21,36.83 27.94,35.56 27.94,34.29 24.13,34.29 20.32,30.48 20.32,29.21 13.97,22.86 J9.9
VREF
  Top 0.508: OPAMP5:U$1.5 24.77,41.27 25.4,41.91 | OPAMP5:U$1.3 26.05,42.55 25.4,41.91 | OPAMP4:U$1.5 40.01,41.27 40.64,41.91 | 41.29,43.18 41.29,42.55 40.64,41.91 | 41.29,43.18 OPAMP4:U$1.3 | OPAMP3:U$1.5 55.24,37.47 55.88,38.1 | 56.52,38.75 OPAMP3:U$1.3 | 55.88,38.1 56.52,38.75 | OPAMP2:U$1.5 69.22,36.2 69.85,36.83 | 70.5,37.48 OPAMP2:U$1.3 | 69.85,36.83 70.5,37.48 | OPAMP1:U$1.3 83.19,37.48 81.91,36.2 OPAMP1:U$1.5 79.39,37.48 70.5,37.48 | 25.4,41.91 40.64,41.91 | 55.88,38.1 50.8,43.18 41.29,43.18 | 69.85,36.83 67.94,38.75 56.52,38.75

### Text on the board
tPlace: ^